# Altium schematic sheet Y1.SchDoc
size A2; SheetNumber: 1; SheetTotal: 1
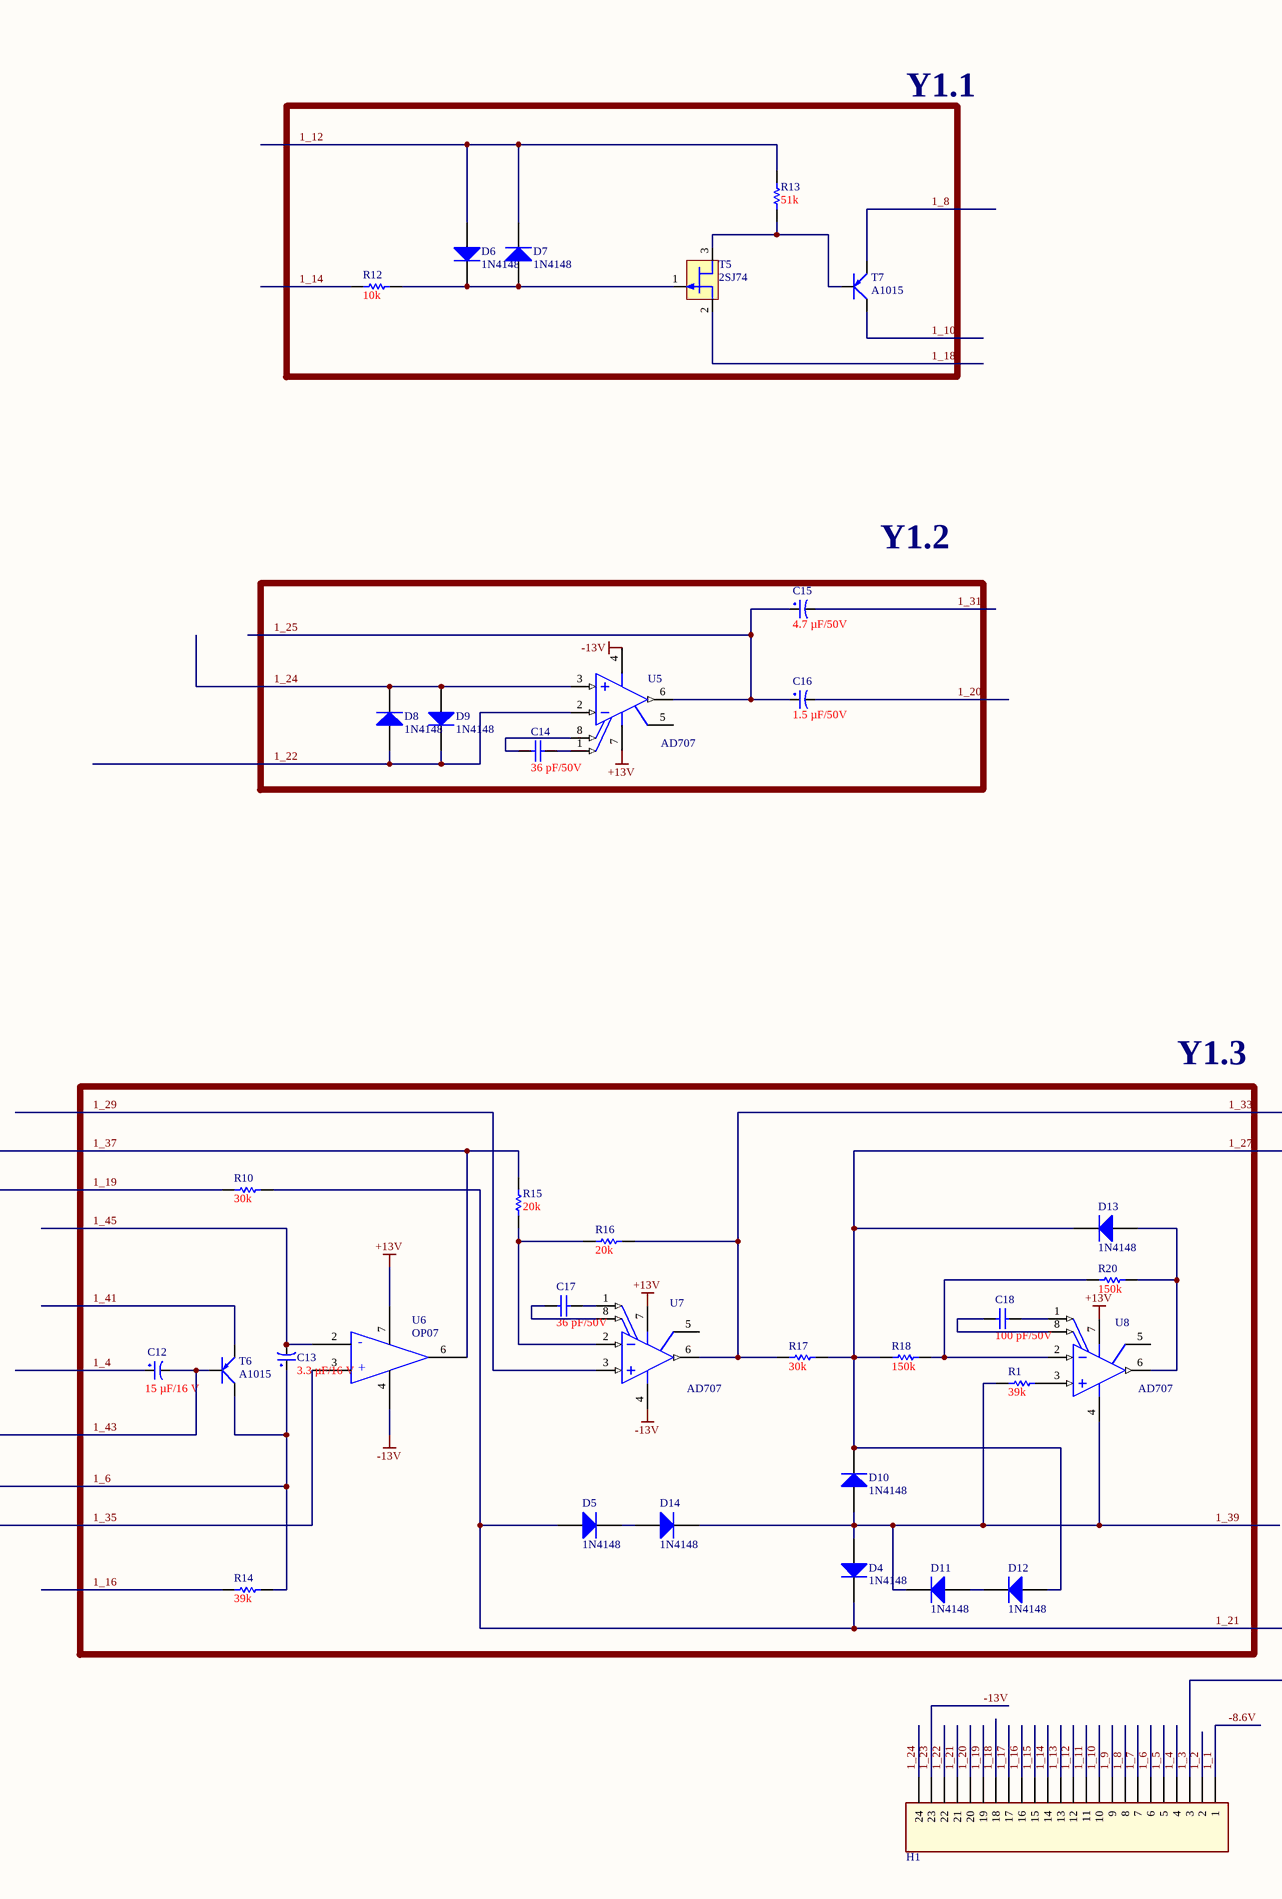
[diagram p0: Y1.SchDoc, left]
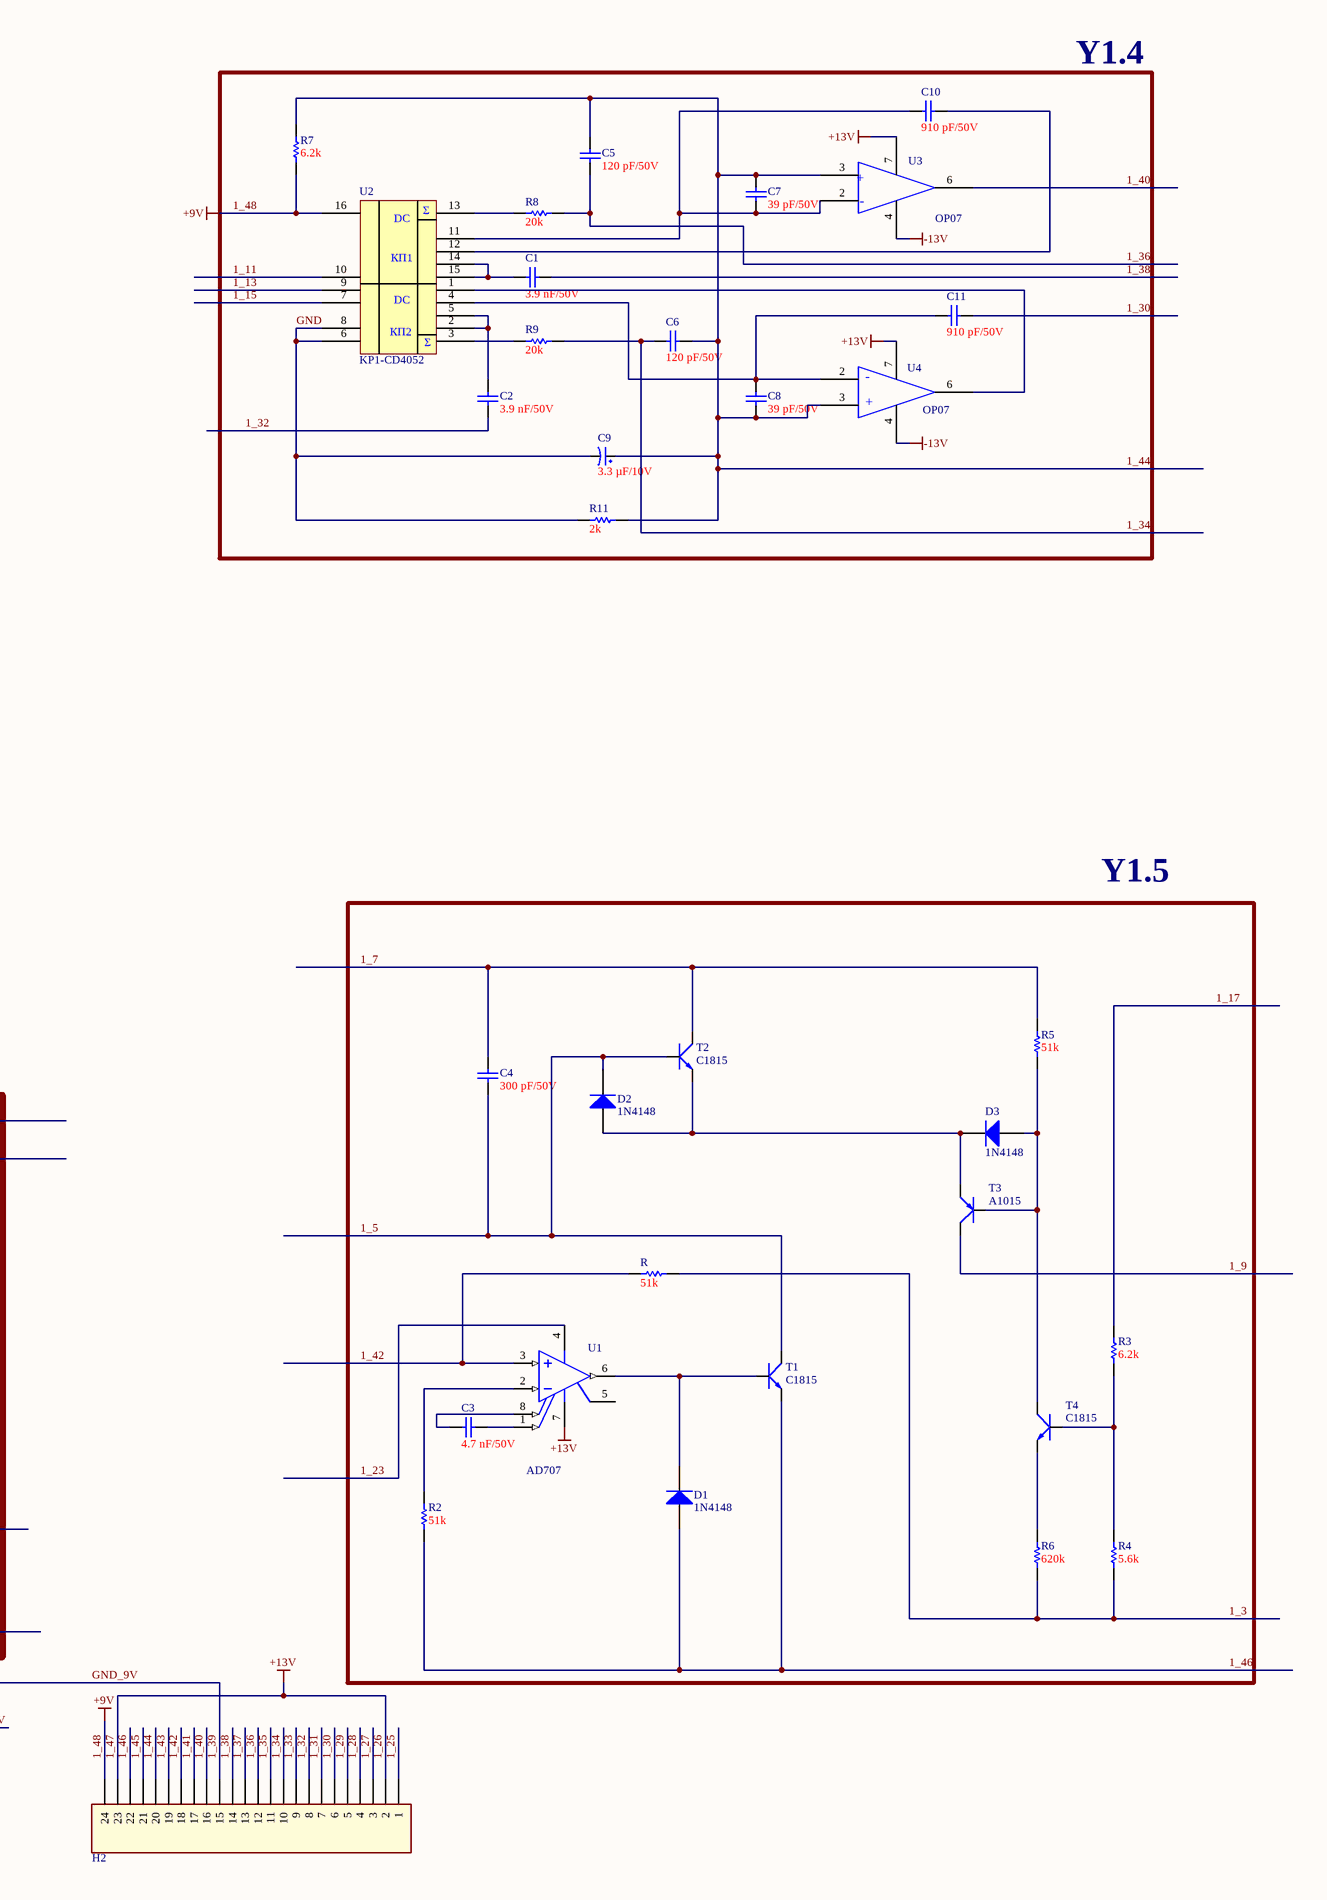
[diagram p1: Y1.SchDoc, right]

## Parts
C1  3.9 nF/50V  [C0805]
C2  3.9 nF/50V  [C0805]
C3  4.7 nF/50V  [C0805]
C4  300 pF/50V  [C0805]
C5  120 pF/50V  [C0805]
C6  120 pF/50V  [C0805]
C7  39 pF/50V  [C0805]
C8  39 pF/50V  [C0805]
C9  3.3 µF/10V  [3216]
C10  910 pF/50V  [C0805]
C11  910 pF/50V  [C0805]
C12  15 µF/16 V  [smd 7343]
C13  3.3 µF/16 V  [3216]
C14  36 pF/50V  [C0805]
C15  4.7 µF/50V  [3216]
C16  1.5 µF/50V  [3216]
C17  36 pF/50V  [C0805]
C18  100 pF/50V  [C0805]
D1  1N4148  [SOD123]
D2  1N4148  [SOD123]
D3  1N4148  [SOD123]
D4  1N4148  [SOD123]
D5  1N4148  [SOD123]
D6  1N4148  [SOD123]
D7  1N4148  [SOD123]
D8  1N4148  [SOD123]
D9  1N4148  [SOD123]
D10  1N4148  [SOD123]
D11  1N4148  [SOD123]
D12  1N4148  [SOD123]
D13  1N4148  [SOD123]
D14  1N4148  [SOD123]
H1  Header 24  [header 24]  (value not drawn)
H2  Header 24  [header 24]  (value not drawn)
R  51k  [R0805]
R1  39k  [R0805]
R2  51k  [R0805]
R3  6.2k  [R0805]
R4  5.6k  [R0805]
R5  51k  [R0805]
R6  620k  [R0805]
R7  6.2k  [R0805]
R8  20k  [R0805]
R9  20k  [R0805]
R10  30k  [R0805]
R11  2k  [R0805]
R12  10k  [R0805]
R13  51k  [R0805]
R14  39k  [R0805]
R15  20k  [R0805]
R16  20k  [R0805]
R17  30k  [R0805]
R18  150k  [R0805]
R20  150k  [R0805]
T1  C1815  [SOT-23]
T2  C1815  [SOT-23]
T3  A1015  [SOT-23]
T4  C1815  [SOT-23]
T5  2SJ74  [TO-92]
T6  A1015  [SOT-23]
T7  A1015  [SOT-23]
U1  AD707  [SOIC8]
U2  KP1-CD4052  [soic16n]
U3  OP07  [soic8]
U4  OP07  [soic8]
U5  AD707  [SOIC8]
U6  OP07  [soic8]
U7  AD707  [SOIC8]
U8  AD707  [SOIC8]

## Blocks framed on the sheet
Y1.1: D6 D7 R12 R13 T5 T7
Y1.4: C1 C2 C5-C11 R7-R9 R11 U2-U4
Y1.5: C3 C4 D1-D3 R R2-R6 T1-T4 U1
Y1.3: C12 C13 C17 C18 D4 D5 D10-D14 R1 R10 R14-R18 R20 T6 U6-U8

## Nets
1_26: H2.2 H2.23 U1.7(VCC+) U3.7 U4.7 U5.7(VCC+) U6.7 U7.7(VCC+) U8.7(VCC+)  [also labelled +13V, 1_47]
1_48: H2.24 R7.1 U2.16  [also labelled +9V]
-13V: H1.23 U1.4(VCC-) U3.4 U4.4 U5.4(VCC-) U6.4 U7.4(VCC-)  [also labelled 1_23]
1_2: H1.2
1_3: D4.1(A) D10.1(A) D11.2(K) D14.2(K) H1.3 H2.15 R.1 R1.2 R4.1 R6.2 U8.4(VCC-)  [also labelled 1_39, GND_9V]
1_4: C12.1 H1.4
1_5: C4.2 D2.2(K) H1.5 T1.3(C) T2.1(B)
1_6: C13.1 H1.6 R14.1 T6.2(C)
1_7: C4.1 H1.7 R5.2 T2.3(C)
1_8: H1.8 T7.1(E)
1_9: H1.9 T3.3(C)
1_10: H1.10 T7.2(C)
1_11: H1.11 U2.10
1_12: D6.1(A) D7.2(K) H1.12 R13.1
1_13: H1.13 U2.9
1_14: H1.14 R12.1
1_15: H1.15 U2.7
1_16: H1.16 R14.2
1_17: H1.17 R3.2
1_18: H1.18 T5.2(D)
1_19: H1.19 R10.2
1_20: C16.2 H1.20
1_21: D4.2(K) D5.1(A) H1.21 R10.1
1_22: D8.1(A) D9.2(K) H1.22 U5.2(IN-)
1_24: D8.2(K) D9.1(A) H1.24 U5.3(IN+)
1_25: C15.1 C16.1 H2.1 U5.6(OUT)
1_27: D10.2(K) D12.1(A) D13.2(K) H2.3 R17.1 R18.2
1_28: H2.4
1_29: H2.5 U7.3(IN+)
1_30: C11.2 H2.6
1_31: C15.2 H2.7
1_32: C2.2 H2.8
1_33: H2.9 R16.1 R17.2 U7.6(OUT)
1_34: C6.2 H2.10 R9.2
1_35: H2.11 U6.3
1_36: C5.2 H2.12 R8.2
1_37: H2.13 R15.1 U6.6
1_38: C1.1 H2.14
1_40: H2.16 U3.6
1_41: H2.17 T6.1(E)
1_42: H2.18 R.2 U1.3(IN+)
1_43: C12.2 H2.19 T6.3(B)
1_44: C5.1 C6.1 C7.1 C8.2 C9.1 H2.20 R7.2 R11.1 U3.3 U4.3
1_45: C13.2 H2.21 U6.2
1_46: D1.1(A) H2.22 R2.1 T1.2(E)
-8.6V: H1.1  [also labelled 1_1]
GND: C9.2 R11.2 U2.6 U2.8
NetC1_2: C1.2 U2.14 U2.15
NetC2_1: C2.1 U2.2 U2.5
NetC3_1: C3.1 U1.1(OFFSET_N1)
NetC3_2: C3.2 U1.8(OFFSET_N2)
NetC7_2: C7.2 C10.1 U2.11 U3.2
NetC8_1: C8.1 C11.1 U2.4 U4.2
NetC10_2: C10.2 U2.12
NetC14_1: C14.1 U5.1(OFFSET_N1)
NetC14_2: C14.2 U5.8(OFFSET_N2)
NetC17_1: C17.1 U7.1(OFFSET_N1)
NetC17_2: C17.2 U7.8(OFFSET_N2)
NetC18_1: C18.1 U8.1(OFFSET_N1)
NetC18_2: C18.2 U8.8(OFFSET_N2)
NetD1_2: D1.2(K) T1.1(B) U1.6(OUT)
NetD2_1: D2.1(A) D3.2(K) T2.2(E) T3.2(E)
NetD3_1: D3.1(A) R5.1 T3.1(B) T4.3(C)
NetD5_2: D5.2(K) D14.1(A)
NetD6_2: D6.2(K) D7.1(A) R12.2 T5.1(G)
NetD11_1: D11.1(A) D12.2(K)
NetD13_1: D13.1(A) R20.2 U8.6(OUT)
NetR1_1: R1.1 U8.3(IN+)
NetR2_2: R2.2 U1.2(IN-)
NetR3_1: R3.1 R4.2 T4.1(B)
NetR6_1: R6.1 T4.2(E)
NetR8_1: R8.1 U2.13
NetR9_1: R9.1 U2.3
NetR13_2: R13.2 T5.3(S) T7.3(B)
NetR15_2: R15.2 R16.2 U7.2(IN-)
NetR18_1: R18.1 R20.1 U8.2(IN-)
NetU2_1: U2.1 U4.6

Not connected (* = marked no-connect by the designer): U1 5(NC); U5 5(NC); U7 5(NC); U8 5(NC)

## Notes on the sheet
- Y1.2
- (in symbol 744UD1A/U1-4) -; +
- (in symbol KP1-CD4052) Σ; DC; КП1; КП2

## Library data of the parts
C1-C8 C10 C11 C14 C17 C18 = Cap ceramic: None polar capacitor; ASiD Part Number: C-AS
  C1 C2: Value: 3.9 nF/50V
  C3: Value: 4.7 nF/50V
  C4: Value: 300 pF/50V
  C5 C6: Value: 120 pF/50V
  C7 C8: Value: 39 pF/50V
  C10 C11: Value: 910 pF/50V
  C14 C17: Value: 36 pF/50V
  C18: Value: 100 pF/50V
C9 = CP2: C 47uF/50V , 220uF/16V; Value: 47uF/16 - 50V; Description 1: 470uF/6,3V - 330uF/10V - 220uF/16V; Description 2: 100uF/25V - 35V - 47uF/50V - 22uF/100V; Description 3: 33uF => 47uF/63V - 1uF => 4,7uF/160V; Description 4: 1uF => 2,2uF/250V - 1uF/350V
C12 C13 C15 C16 = CP1: Cap P  0,1uF < 22uF , 16 - 50V; Value: 10uF/50V; Description 1: 10 => 220uF/6,3V/10V - 10uF => 100uF/16V; Description 2: 0,1uF => 33uF/50V - 10uF => 22uF/63V; Description 3: 0,47uF => 10uF/100V
D1-D14 = Diode S4: Dán; Ten_Linh_Kien: Diode S4 SOD123 ( 1N5819 SOD123); Ma_Hang: MH005519; Don_Vi: Con; Ghi_Chu: *; Chung_Loai: Dán; Kieu_Chan: *
R R1-R18 R20 = Res: Standard resistor; ASiD Part Number: Res-AS
  R R2 R5 R13: Value: 51k
  R1 R14: Value: 39k
  R3 R7: Value: 6.2k
  R4: Value: 5.6k
  R6: Value: 620k
  R8 R9 R15 R16: Value: 20k
  R10 R17: Value: 30k
  R11: Value: 2k
  R12: Value: 10k
  R18 R20: Value: 150k
T1 T2 T4 = Trans C1815 HF SMD: SOT-23; Value: C9014
T3 = Trans A1015 BA SMD: PNP 600mW, ECB
T5 = JFET P CHANNEL
T6 T7 = PNP_ECB: P 600mW, ECB; Value: A1015
U1 U5 U7 U8 = OP07DD: Low-Offset Voltage Operational Amplifier, 6 to 36 V, 0 to 70 degC, 8-pin SOIC (D8), Green (RoHS & no Sb/Br); Manufacturer: Texas Instruments; CMRR(Min)(dB): 94; GBW(Typ)(MHz): 0.6; IIB(Max)(pA): 12000; Iq per channel(Max)(mA): 5; Number of Channels: 1; Offset Drift(Typ)(uV/C): 0.7; Rating: Catalog; Slew Rate(Typ)(V/us): 0.3; Sub Family: General Purpose Amplifier, High Supply Voltage Amplifier (>=30V), Low Noise Amp (<=10nV/rtHz), Low Offset Voltage Amplifier (<=500uV); Total Supply Voltage(Max)(+5V is 5, +/-5V is 10): 36; Total Supply Voltage(Min)(+5V is 5, +/-5V is 10): 6; Vio (25C)(Max)(mV): 0.15; Vn at 1kHz(Typ)(nV/rtHz): 9.8; DatasheetVersion: SLOS099E; PackageVersion: 4040047-3/M, 06/2011; PackageReference: D8; PackageDescription: 8-Pin Plastic Small Outline, Body 4.9 x 3.9 mm, Pitch 1.27 mm; Supplier 1: Digi-Key; Supplier Part Number 1: 296-9621-5-ND; Supplier 2: Farnell; Supplier Part Number 2: 1459541; Supplier 3: Newark; Supplier Part Number 3: 61M8137; Supplier 4: Newark; Supplier Part Number 4: 91B7408; Supplier 5: Mouser; Supplier Part Number 5: 595-OP07DD; Eco-Plan: Green (RoHS & no Sb/Br); Mounting Technology: Surface Mount; Code_JEDEC: MS-012; PartNumber: OP07DD; ComponentLink1Description: Manufacturer URL; ComponentLink1URL: http://www.ti.com/; ComponentLink2Description: Datasheet; ComponentLink2URL: http://www.ti.com/lit/ds/symlink/op07d.pdf; ComponentLink3Description: Package Specification; ComponentLink3URL: http://www.ti.com/litv/pdf/msoi002j
U3 U4 U6 = 744UD1A/U1-4